# Altium schematic sheet Sensor Inputs.SchDoc
size A4; SheetNumber: 2; SheetTotal: 5
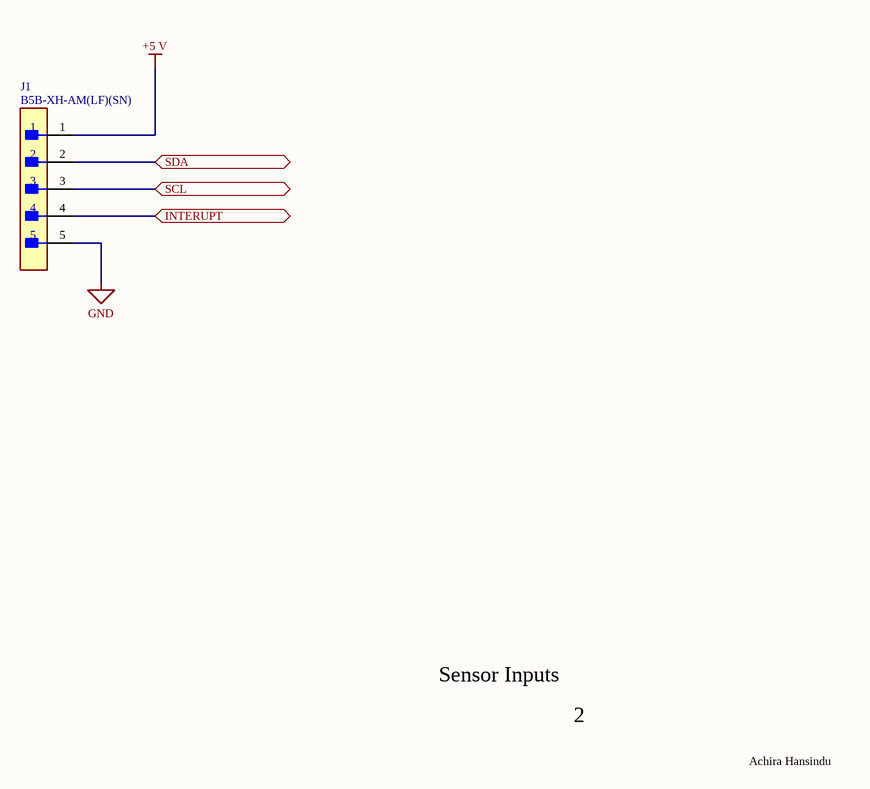
[diagram p0: Sensor Inputs.SchDoc]

## Parts
J1  B5B-XH-AM(LF)(SN)  [FP-B5B-XH-AM_LF_SN-MFG]

## Ports
INTERUPT (bidir, see Main[2B], MCU[3B]), SCL (bidir, see Main[2B], MCU[3B]), SDA (bidir, see Main[2B], MCU[3B])

## Nets
+5 V: J1.1
GND: J1.5
INTERUPT: J1.4 ; port INTERUPT
SCL: J1.3 ; port SCL
SDA: J1.2 ; port SDA

## Notes on the sheet
- Sensor Inputs
- 2
- Achira Hansindu

## Library data of the parts
J1 = CMP-17439-000304-1: CONN HEADER VERT 5POS 2.5MM; Mated Stacking Heights: 9.8mm; Voltage Rating: 250V; Max Current Rating: 3A; Number of Positions: 5; Contact Resistance: 20mR; Depth: 5.75mm; Connector Type: Header; Color: Green; Insulation Material: Nylon; Contact Plating: Copper; Length: 14.9mm; Fastening Type: Detent; Contact Material: Brass; Number of Rows: 1; Contact Type: Male Pin; Housing Material: Polyamide; Housing Color: White; Lead Free: Lead Free; Max Voltage Rating (AC): 250V; Mount: Through Hole; Contact Shape: Square; Min Operating Temperature: -25°C; Packaging: Bulk; Orientation: Straight; Insulation Color: Natural; Series: XH; Flammability Rating: UL94 V-0; Contact Finish - Mating: TIN; Max Operating Temperature: 85°C; Termination: Solder; Pitch: 2.5mm